# EAGLE design 16-Bit Register (EAGLE 7.5.0)
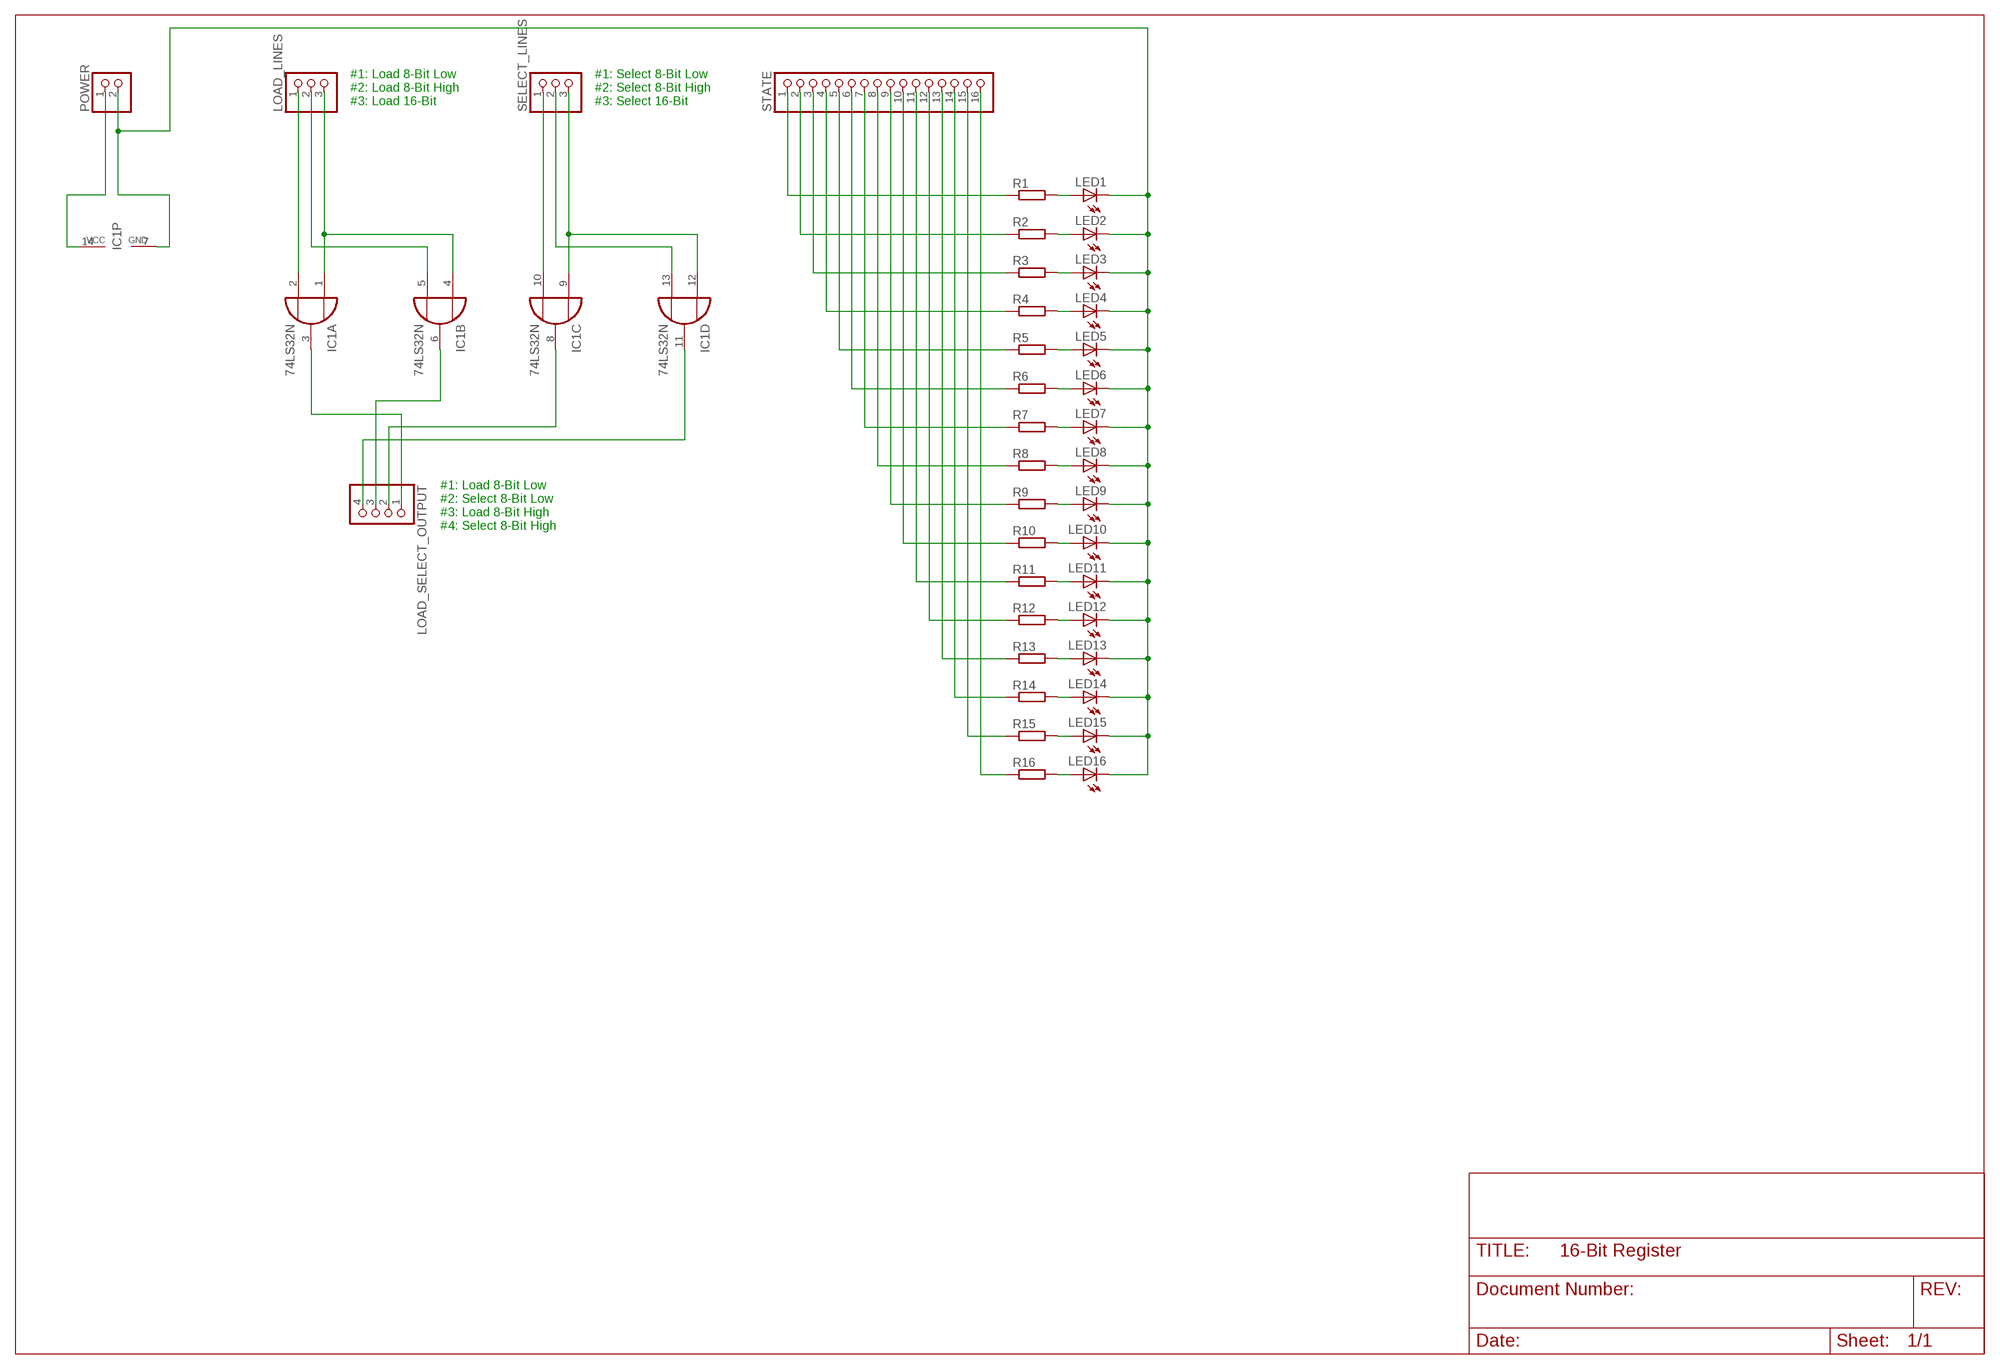
[diagram p0: schematic, sheet 1]

## Parts
IC1  74LS32N  [DIL14]
LED1  LED3MM  [LED3MM]
LED2  LED3MM  [LED3MM]
LED3  LED3MM  [LED3MM]
LED4  LED3MM  [LED3MM]
LED5  LED3MM  [LED3MM]
LED6  LED3MM  [LED3MM]
LED7  LED3MM  [LED3MM]
LED8  LED3MM  [LED3MM]
LED9  LED3MM  [LED3MM]
LED10  LED3MM  [LED3MM]
LED11  LED3MM  [LED3MM]
LED12  LED3MM  [LED3MM]
LED13  LED3MM  [LED3MM]
LED14  LED3MM  [LED3MM]
LED15  LED3MM  [LED3MM]
LED16  LED3MM  [LED3MM]
LOAD_LINES  PINHD-1X3  [1X03]
LOAD_SELECT_OUTPUT  PINHD-1X4  [1X04]
POWER  PINHD-1X2  [1X02]
R1  R-EU_0207/7  [0207/7]
R2  R-EU_0207/7  [0207/7]
R3  R-EU_0207/7  [0207/7]
R4  R-EU_0207/7  [0207/7]
R5  R-EU_0207/7  [0207/7]
R6  R-EU_0207/7  [0207/7]
R7  R-EU_0207/7  [0207/7]
R8  R-EU_0207/7  [0207/7]
R9  R-EU_0207/7  [0207/7]
R10  R-EU_0207/7  [0207/7]
R11  R-EU_0207/7  [0207/7]
R12  R-EU_0207/7  [0207/7]
R13  R-EU_0207/7  [0207/7]
R14  R-EU_0207/7  [0207/7]
R15  R-EU_0207/7  [0207/7]
R16  R-EU_0207/7  [0207/7]
SELECT_LINES  PINHD-1X3  [1X03]
STATE  PINHD-1X16  [1X16]

## Nets
GND: IC1.7(P:GND) LED1.K(C) LED2.K(C) LED3.K(C) LED4.K(C) LED5.K(C) LED6.K(C) LED7.K(C) LED8.K(C) LED9.K(C) LED10.K(C) LED11.K(C) LED12.K(C) LED13.K(C) LED14.K(C) LED15.K(C) LED16.K(C) POWER.2
N$1: IC1.2(A:I1) LOAD_LINES.1
N$2: IC1.1(A:I0) IC1.4(B:I0) LOAD_LINES.3
N$3: IC1.5(B:I1) LOAD_LINES.2
N$4: IC1.10(C:I1) SELECT_LINES.1
N$5: IC1.9(C:I0) IC1.12(D:I0) SELECT_LINES.3
N$6: IC1.13(D:I1) SELECT_LINES.2
N$7: IC1.3(A:O) LOAD_SELECT_OUTPUT.1
N$8: IC1.6(B:O) LOAD_SELECT_OUTPUT.3
N$9: IC1.8(C:O) LOAD_SELECT_OUTPUT.2
N$10: IC1.11(D:O) LOAD_SELECT_OUTPUT.4
N$11: R1.1 STATE.1
N$12: R2.1 STATE.2
N$13: R3.1 STATE.3
N$14: R4.1 STATE.4
N$15: R5.1 STATE.5
N$16: R6.1 STATE.6
N$17: R7.1 STATE.7
N$18: R8.1 STATE.8
N$19: R9.1 STATE.9
N$20: R10.1 STATE.10
N$21: R11.1 STATE.11
N$22: R12.1 STATE.12
N$23: R13.1 STATE.13
N$24: R14.1 STATE.14
N$25: R15.1 STATE.15
N$26: R16.1 STATE.16
N$27: LED16.A R16.2
N$28: LED15.A R15.2
N$29: LED14.A R14.2
N$30: LED13.A R13.2
N$31: LED12.A R12.2
N$32: LED11.A R11.2
N$33: LED10.A R10.2
N$34: LED9.A R9.2
N$35: LED8.A R8.2
N$36: LED7.A R7.2
N$37: LED6.A R6.2
N$38: LED5.A R5.2
N$39: LED4.A R4.2
N$40: LED3.A R3.2
N$41: LED2.A R2.2
N$42: LED1.A R1.2
VCC: IC1.14(P:VCC) POWER.1

## Notes on the sheet
- #1: Load 8-Bit Low
  #2: Load 8-Bit High
  #3: Load 16-Bit
- #1: Select 8-Bit Low
  #2: Select 8-Bit High
  #3: Select 16-Bit
- #1: Load 8-Bit Low
  #2: Select 8-Bit Low
  #3: Load 8-Bit High
  #4: Select 8-Bit High

## Library data of the parts
IC1 = 74xx-eu:74*32: Quad 2-input OR gate
LED1-LED16 = led:LED: LED OSRAM: - CHIPLED LG R971, LG N971, LY N971, LG Q971, LY Q971, LO R971, LY R971 LH N974, LH R974 LS Q976, LO Q976, LY Q976 LO Q996 - Hyper CHIPLED LW Q18S LB Q993, LB Q99A, LB R99A - SideLED LS A670, LO A670, LY A670, LG A670, LP A670 LB A673, LV A673, LT A673, LW A673 LH A674 LY A675 LS A676, LA A676, LO A676, LY A676, LW A676 LS A679, LY A679, LG A679 - Hyper Micro SIDELED® LS Y876, LA Y876, LO Y876, LY Y876 LT Y87S - SmartLED LW L88C, LW L88S LB L89C, LB L89S, LG L890 LS L89K, LO L89K, LY L89K LS L896, LA L896, LO L896, LY L896 - TOPLED LS T670, LO T670, LY T670, LG T670, LP T670 LSG T670, LSP T670, LSY T670, LOP T670, LYG T670 LG T671, LOG T671, LSG T671 LB T673, LV T673, LT T673, LW T673 LH T674 LS T676, LA T676, LO T676, LY T676, LB T676, LH T676, LSB T676, LW T676 LB T67C, LV T67C, LT T67C, LS T67K, LO T67K, LY T67K, LW E67C LS E67B, LA E67B, LO E67B, LY E67B, LB E67C, LV E67C, LT E67C LW T67C LS T679, LY T679, LG T679 LS T770, LO T770, LY T770, LG T770, LP T770 LB T773, LV T773, LT T773, LW T773 LH T774 LS E675, LA E675, LY E675, LS T675 LS T776, LA T776, LO T776, LY T776, LB T776 LHGB T686 LT T68C, LB T68C - Hyper Mini TOPLED® LB M676 - Mini TOPLED Santana® LG M470 LS M47K, LO M47K, LY M47K Source: http://www.osram.convergy.de LUXEON: - LUMILED® LXK2-PW12-R00, LXK2-PW12-S00, LXK2-PW14-U00, LXK2-PW14-V00 LXK2-PM12-R00, LXK2-PM12-S00, LXK2-PM14-U00 LXK2-PE12-Q00, LXK2-PE12-R00, LXK2-PE12-S00, LXK2-PE14-T00, LXK2-PE14-U00 LXK2-PB12-K00, LXK2-PB12-L00, LXK2-PB12-M00, LXK2-PB14-N00, LXK2-PB14-P00, LXK2-PB14-Q00 LXK2-PR12-L00, LXK2-PR12-M00, LXK2-PR14-Q00, LXK2-PR14-R00 LXK2-PD12-Q00, LXK2-PD12-R00, LXK2-PD12-S00 LXK2-PH12-R00, LXK2-PH12-S00 LXK2-PL12-P00, LXK2-PL12-Q00, LXK2-PL12-R00 Source: www.luxeon.com KINGBRIGHT: KA-3528ASYC Source: www.kingbright.com
LOAD_LINES SELECT_LINES = pinhead:PINHD-1X3: PIN HEADER
LOAD_SELECT_OUTPUT = pinhead:PINHD-1X4: PIN HEADER
POWER = pinhead:PINHD-1X2: PIN HEADER
R1-R16 = resistor:R-EU_: RESISTOR, European symbol
STATE = pinhead:PINHD-1X16: PIN HEADER

## Board
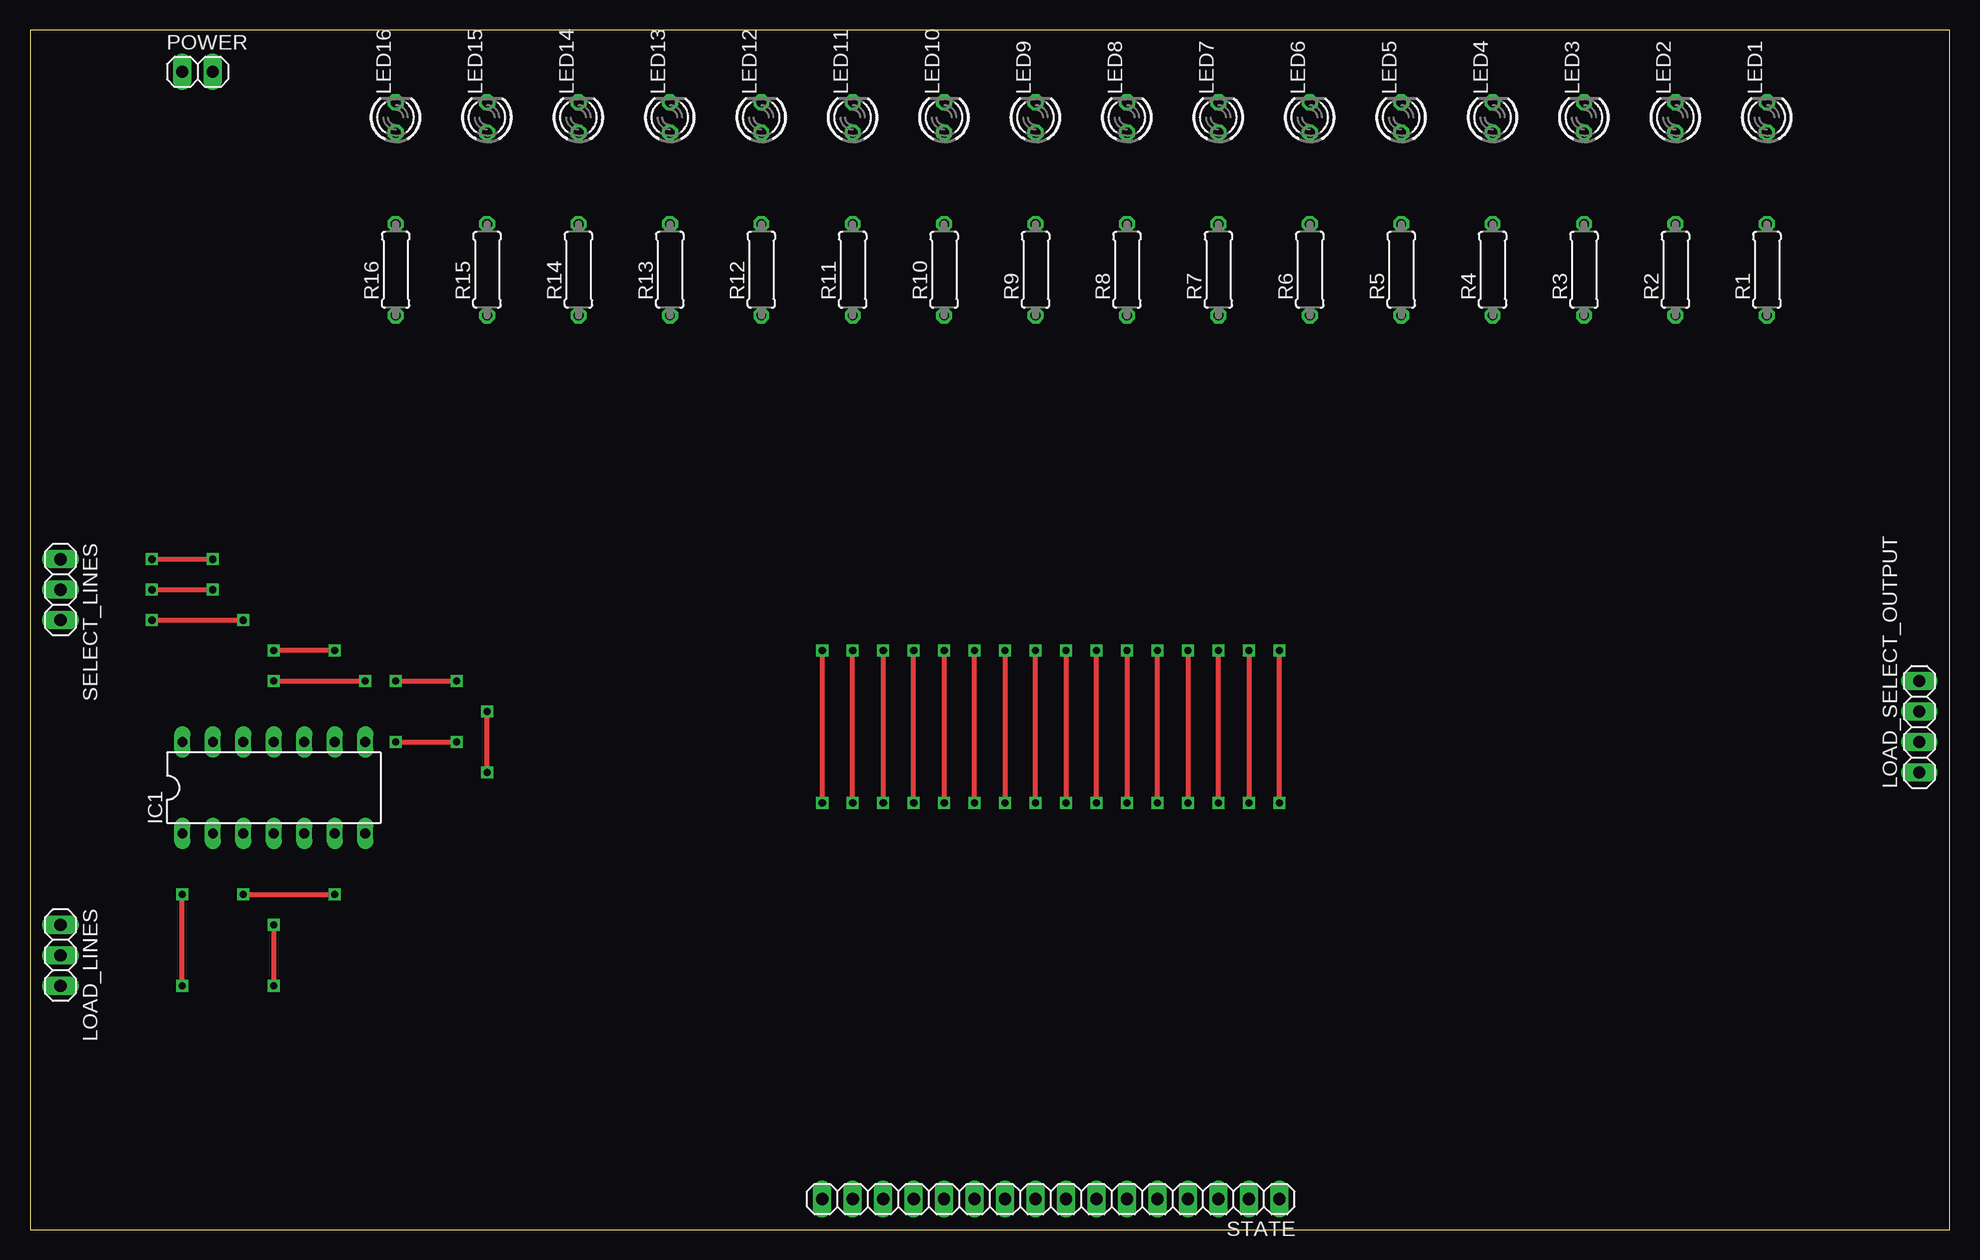
[diagram p1: board, top side]
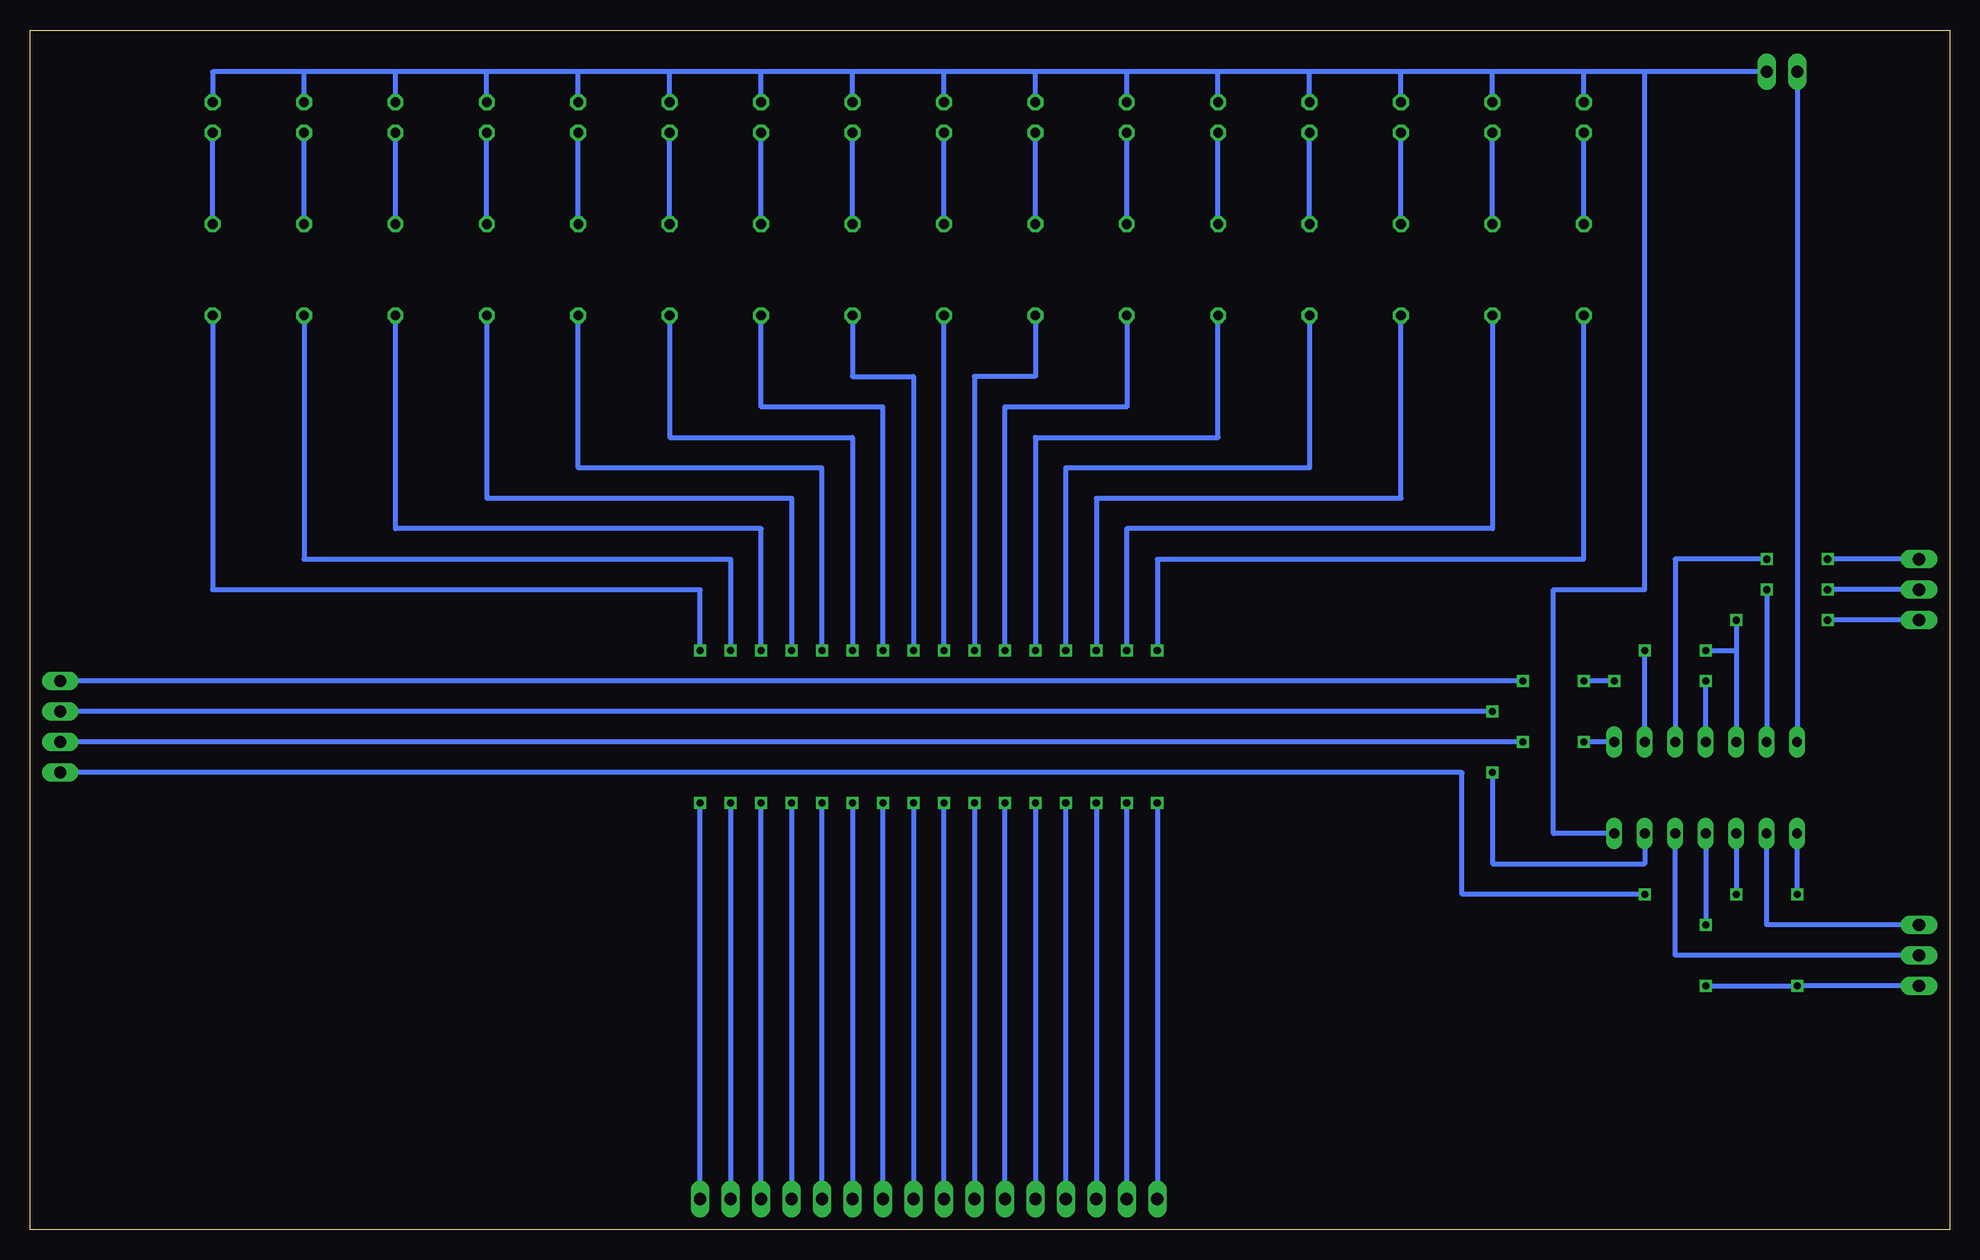
[diagram p2: board, bottom side, seen from below]

Size 160 x 100 mm. Coordinates in mm from the lower left corner, seen from the top.
Outline: 0,0 160,0 160,100 0,100 0,0
Copper layers (1*16): Top 0.035mm / dielectric 1.5mm / Bottom 0.035mm
Design rules "default": minimum track width 10mil, minimum drill 24mil, track to track 8mil, track to pad 8mil, pad to pad 8mil, via to via 8mil, smd to smd 8mil, copper to edge 40mil, drill to drill 8mil, minimum pad ring 10mil, minimum via ring 8mil, stop-mask expansion 4mil, vias tented up to drill 0mil, thermal gap 10mil

### Footprints (pad centres in the part's own frame; a part is rotated, then mirrored left to right if it is on the bottom)
DIL14 = drill 0.813 long: 1 -7.62,-3.81; 2 -5.08,-3.81; 3 -2.54,-3.81; 4 0,-3.81; 5 2.54,-3.81; 6 5.08,-3.81; 7 7.62,-3.81; 8 7.62,3.81; 9 5.08,3.81; 10 2.54,3.81; 11 0,3.81; 12 -2.54,3.81; 13 -5.08,3.81; 14 -7.62,3.81
LED3MM = drill 0.813 octagon: A -1.27,0; K 1.27,0
1X03 = drill 1.016 long: 1 -2.54,0; 2 0,0; 3 2.54,0
1X04 = drill 1.016 long: 1 -3.81,0; 2 -1.27,0; 3 1.27,0; 4 3.81,0
1X02 = drill 1.016 long: 1 -1.27,0; 2 1.27,0
0207/7 = drill 0.813 octagon: 1 -3.81,0; 2 3.81,0
1X16 = drill 1.016 long: 1 -19.05,0; 2 -16.51,0; 3 -13.97,0; 4 -11.43,0; 5 -8.89,0; 6 -6.35,0; 7 -3.81,0; 8 -1.27,0; 9 1.27,0; 10 3.81,0; 11 6.35,0; 12 8.89,0; 13 11.43,0; 14 13.97,0; 15 16.51,0; 16 19.05,0

### Placement (x,y rotation side)
IC1  20.32,36.83 0 top
LED1  144.78,92.71 90 top
LED2  137.16,92.71 90 top
LED3  129.54,92.71 90 top
LED4  121.92,92.71 90 top
LED5  114.3,92.71 90 top
LED6  106.68,92.71 90 top
LED7  99.06,92.71 90 top
LED8  91.44,92.71 90 top
LED9  83.82,92.71 90 top
LED10  76.2,92.71 90 top
LED11  68.58,92.71 90 top
LED12  60.96,92.71 90 top
LED13  53.34,92.71 90 top
LED14  45.72,92.71 90 top
LED15  38.1,92.71 90 top
LED16  30.48,92.71 90 top
LOAD_LINES  2.54,22.86 270 top
LOAD_SELECT_OUTPUT  157.48,41.91 90 top
POWER  13.97,96.52 0 top
R1  144.78,80.01 90 top
R2  137.16,80.01 90 top
R3  129.54,80.01 90 top
R4  121.92,80.01 90 top
R5  114.3,80.01 90 top
R6  106.68,80.01 90 top
R7  99.06,80.01 90 top
R8  91.44,80.01 90 top
R9  83.82,80.01 90 top
R10  76.2,80.01 90 top
R11  68.58,80.01 90 top
R12  60.96,80.01 90 top
R13  53.34,80.01 90 top
R14  45.72,80.01 90 top
R15  38.1,80.01 90 top
R16  30.48,80.01 90 top
SELECT_LINES  2.54,53.34 270 top
STATE  85.09,2.54 180 top

### Tracks (layer width: path | path; a pad name or v marks a point on that pad's centre or on a via)
GND
  Bottom 0.406: POWER.2 25.4,96.52 | 25.4,96.52 30.48,96.52 | 30.48,96.52 38.1,96.52 | 38.1,96.52 45.72,96.52 | 45.72,96.52 53.34,96.52 | 53.34,96.52 60.96,96.52 | 60.96,96.52 68.58,96.52 | 68.58,96.52 76.2,96.52 | 76.2,96.52 83.82,96.52 | 83.82,96.52 91.44,96.52 | 91.44,96.52 99.06,96.52 | 99.06,96.52 106.68,96.52 | 106.68,96.52 114.3,96.52 | 114.3,96.52 121.92,96.52 | 121.92,96.52 129.54,96.52 | 129.54,96.52 137.16,96.52 | 137.16,96.52 144.78,96.52 LED1.K | LED2.K 137.16,96.52 | LED3.K 129.54,96.52 | LED4.K 121.92,96.52 | LED5.K 114.3,96.52 | LED6.K 106.68,96.52 | LED7.K 99.06,96.52 | LED8.K 91.44,96.52 | LED9.K 83.82,96.52 | LED10.K 76.2,96.52 | LED11.K 68.58,96.52 | LED12.K 60.96,96.52 | LED13.K 53.34,96.52 | LED14.K 45.72,96.52 | LED15.K 38.1,96.52 | LED16.K 30.48,96.52 | IC1.7 33.02,33.02 33.02,53.34 25.4,53.34 25.4,96.52
N$1
  Bottom 0.406: LOAD_LINES.1 15.24,25.4 IC1.2
N$2  (via drill 0.6)
  Top 0.406: v12.7,20.32 v12.7,27.94 | v20.32,25.4 v20.32,20.32
  Bottom 0.406: LOAD_LINES.3 v12.7,20.32 v20.32,20.32 | v12.7,27.94 IC1.1 | IC1.4 v20.32,25.4
N$3
  Bottom 0.406: LOAD_LINES.2 22.86,22.86 IC1.5
N$4  (via drill 0.6)
  Top 0.406: v10.16,55.88 v15.24,55.88
  Bottom 0.406: SELECT_LINES.1 v10.16,55.88 | v15.24,55.88 22.86,55.88 IC1.10
N$5  (via drill 0.6)
  Top 0.406: v10.16,50.8 v17.78,50.8 | v25.4,48.26 v20.32,48.26
  Bottom 0.406: SELECT_LINES.3 v10.16,50.8 | v17.78,50.8 17.78,48.26 | 17.78,48.26 IC1.12 | IC1.9 v25.4,48.26 | v20.32,48.26 17.78,48.26
N$6  (via drill 0.6)
  Top 0.406: v10.16,53.34 v15.24,53.34
  Bottom 0.406: SELECT_LINES.2 v10.16,53.34 | v15.24,53.34 IC1.13
N$7  (via drill 0.6)
  Top 0.406: v17.78,27.94 v25.4,27.94
  Bottom 0.406: IC1.3 v17.78,27.94 | v25.4,27.94 40.64,27.94 40.64,38.1 LOAD_SELECT_OUTPUT.1
N$8  (via drill 0.6)
  Top 0.406: v38.1,38.1 v38.1,43.18
  Bottom 0.406: IC1.6 25.4,30.48 38.1,30.48 v38.1,38.1 | v38.1,43.18 LOAD_SELECT_OUTPUT.3
N$9  (via drill 0.6)
  Top 0.406: v30.48,40.64 v35.56,40.64
  Bottom 0.406: IC1.8 v30.48,40.64 | v35.56,40.64 LOAD_SELECT_OUTPUT.2
N$10  (via drill 0.6)
  Top 0.406: v20.32,45.72 v27.94,45.72 | v30.48,45.72 v35.56,45.72
  Bottom 0.406: IC1.11 v20.32,45.72 | v27.94,45.72 v30.48,45.72 | v35.56,45.72 LOAD_SELECT_OUTPUT.4
N$11  (via drill 0.6)
  Top 0.406: v104.14,35.56 v104.14,48.26
  Bottom 0.406: R1.1 144.78,53.34 104.14,53.34 v104.14,48.26 | STATE.1 v104.14,35.56
N$12  (via drill 0.6)
  Top 0.406: v101.6,48.26 v101.6,35.56
  Bottom 0.406: R2.1 137.16,55.88 101.6,55.88 v101.6,48.26 | v101.6,35.56 STATE.2
N$13  (via drill 0.6)
  Top 0.406: v99.06,35.56 v99.06,48.26
  Bottom 0.406: R3.1 129.54,58.42 99.06,58.42 v99.06,48.26 | STATE.3 v99.06,35.56
N$14  (via drill 0.6)
  Top 0.406: v96.52,48.26 v96.52,35.56
  Bottom 0.406: R4.1 121.92,60.96 96.52,60.96 v96.52,48.26 | v96.52,35.56 STATE.4
N$15  (via drill 0.6)
  Top 0.406: v93.98,35.56 v93.98,48.26
  Bottom 0.406: R5.1 114.3,63.5 93.98,63.5 v93.98,48.26 | STATE.5 v93.98,35.56
N$16  (via drill 0.6)
  Top 0.406: v91.44,48.26 v91.44,35.56
  Bottom 0.406: R6.1 106.68,66.04 91.44,66.04 v91.44,48.26 | v91.44,35.56 STATE.6
N$17  (via drill 0.6)
  Top 0.406: v88.9,35.56 v88.9,48.26
  Bottom 0.406: R7.1 99.06,68.58 88.9,68.58 v88.9,48.26 | STATE.7 v88.9,35.56
N$18  (via drill 0.6)
  Top 0.406: v86.36,48.26 v86.36,35.56
  Bottom 0.406: R8.1 91.44,71.12 86.36,71.12 v86.36,48.26 | v86.36,35.56 STATE.8
N$19  (via drill 0.6)
  Top 0.406: v83.82,35.56 v83.82,48.26
  Bottom 0.406: STATE.9 v83.82,35.56 | v83.82,48.26 R9.1
N$20  (via drill 0.6)
  Top 0.406: v81.28,48.26 v81.28,35.56
  Bottom 0.406: R10.1 76.2,71.12 81.28,71.12 v81.28,48.26 | v81.28,35.56 STATE.10
N$21  (via drill 0.6)
  Top 0.406: v78.74,35.56 v78.74,48.26
  Bottom 0.406: R11.1 68.58,68.58 78.74,68.58 v78.74,48.26 | STATE.11 v78.74,35.56
N$22  (via drill 0.6)
  Top 0.406: v76.2,48.26 v76.2,35.56
  Bottom 0.406: R12.1 60.96,66.04 76.2,66.04 v76.2,48.26 | v76.2,35.56 STATE.12
N$23  (via drill 0.6)
  Top 0.406: v73.66,35.56 v73.66,48.26
  Bottom 0.406: R13.1 53.34,63.5 73.66,63.5 v73.66,48.26 | STATE.13 v73.66,35.56
N$24  (via drill 0.6)
  Top 0.406: v71.12,48.26 v71.12,35.56
  Bottom 0.406: R14.1 45.72,60.96 71.12,60.96 v71.12,48.26 | v71.12,35.56 STATE.14
N$25  (via drill 0.6)
  Top 0.406: v68.58,35.56 v68.58,48.26
  Bottom 0.406: R15.1 38.1,58.42 68.58,58.42 v68.58,48.26 | STATE.15 v68.58,35.56
N$26  (via drill 0.6)
  Top 0.406: v66.04,48.26 v66.04,35.56
  Bottom 0.406: R16.1 30.48,55.88 66.04,55.88 v66.04,48.26 | v66.04,35.56 STATE.16
N$27
  Bottom 0.406: R16.2 LED16.A
N$28
  Bottom 0.406: R15.2 LED15.A
N$29
  Bottom 0.406: R14.2 LED14.A
N$30
  Bottom 0.406: R13.2 LED13.A
N$31
  Bottom 0.406: R12.2 LED12.A
N$32
  Bottom 0.406: R11.2 LED11.A
N$33
  Bottom 0.406: R10.2 LED10.A
N$34
  Bottom 0.406: R9.2 LED9.A
N$35
  Bottom 0.406: R8.2 LED8.A
N$36
  Bottom 0.406: R7.2 LED7.A
N$37
  Bottom 0.406: R6.2 LED6.A
N$38
  Bottom 0.406: R5.2 LED5.A
N$39
  Bottom 0.406: R4.2 LED4.A
N$40
  Bottom 0.406: R3.2 LED3.A
N$41
  Bottom 0.406: R2.2 LED2.A
N$42
  Bottom 0.406: R1.2 LED1.A
VCC
  Bottom 0.406: POWER.1 IC1.14